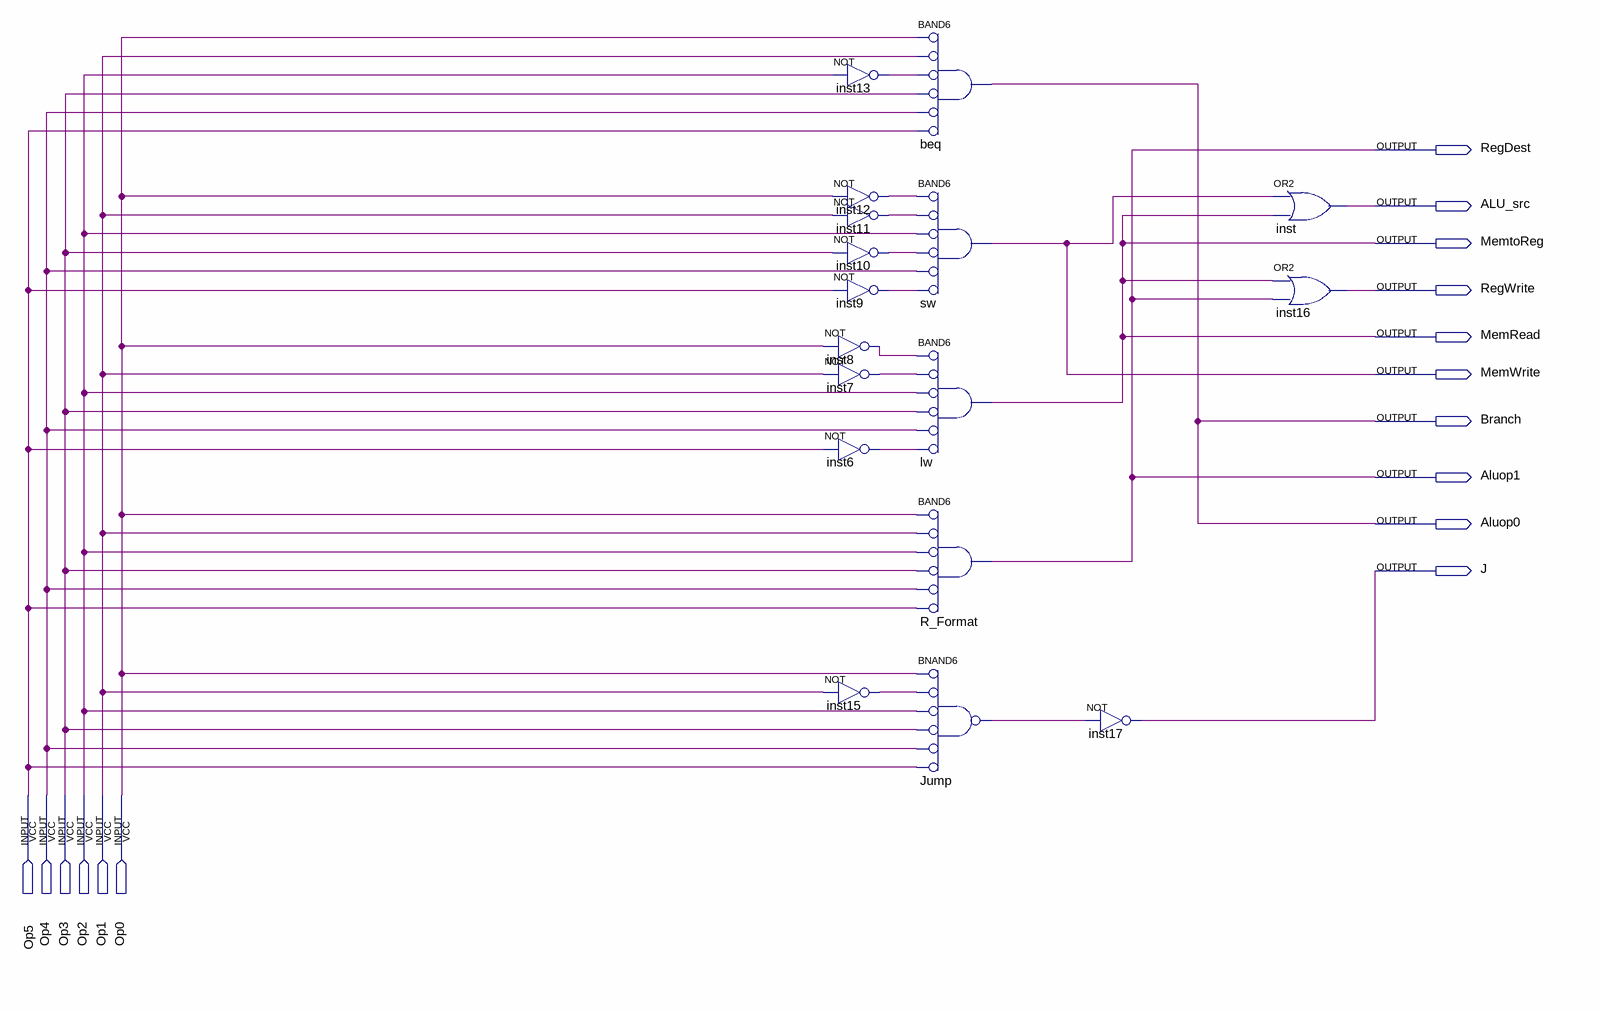
[diagram p0: schematic sheet]
// Quartus schematic Control.bdf as structural Verilog: 17 symbols, 16 pins
module Control (
  input  Op5,
  input  Op4,
  input  Op3,
  input  Op2,
  input  Op1,
  input  Op0,
  output RegDest,
  output ALU_src,
  output MemtoReg,
  output RegWrite,
  output MemRead,
  output MemWrite,
  output Branch,
  output Aluop1,
  output Aluop0,
  output J
);

  wire inst6_out, inst7_out, inst8_out, inst9_out, inst10_out, inst11_out, inst12_out, inst13_out,
       inst15_out, Jump_out;

  not inst13 (inst13_out, Op2);
  not inst12 (inst12_out, Op0);
  not inst11 (inst11_out, Op1);
  not inst10 (inst10_out, Op3);
  not inst9 (inst9_out, Op5);
  not inst8 (inst8_out, Op0);
  not inst7 (inst7_out, Op1);
  not inst6 (inst6_out, Op5);
  not inst15 (inst15_out, Op1);
  and beq (Aluop0, ~Op0, ~Op1, ~inst13_out, ~Op3, ~Op4, ~Op5);  // BAND6
  and sw (MemWrite, ~inst12_out, ~inst11_out, ~Op2, ~inst10_out, ~Op4, ~inst9_out);  // BAND6
  and lw (MemRead, ~inst8_out, ~inst7_out, ~Op2, ~Op3, ~Op4, ~inst6_out);  // BAND6
  and R_Format (Aluop1, ~Op0, ~Op1, ~Op2, ~Op3, ~Op4, ~Op5);  // BAND6
  nand Jump (Jump_out, ~Op0, ~inst15_out, ~Op2, ~Op3, ~Op4, ~Op5);  // BNAND6
  not inst17 (J, Jump_out);
  or inst (ALU_src, MemWrite, MemRead);
  or inst16 (RegWrite, MemRead, Aluop1);

  assign Branch = Aluop0;
  assign MemtoReg = MemRead;
  assign RegDest = Aluop1;
endmodule
